# EasyEDA schematic SCH_Glucosan2-DetectorSide.json
TITLE: Glucosan 2 - Detector Side; REV: 1.0; Date: 2024-07-13; Sheet: 1/1; Drawn By: KnowTheBird; Company: NoninvasiveGlucometer
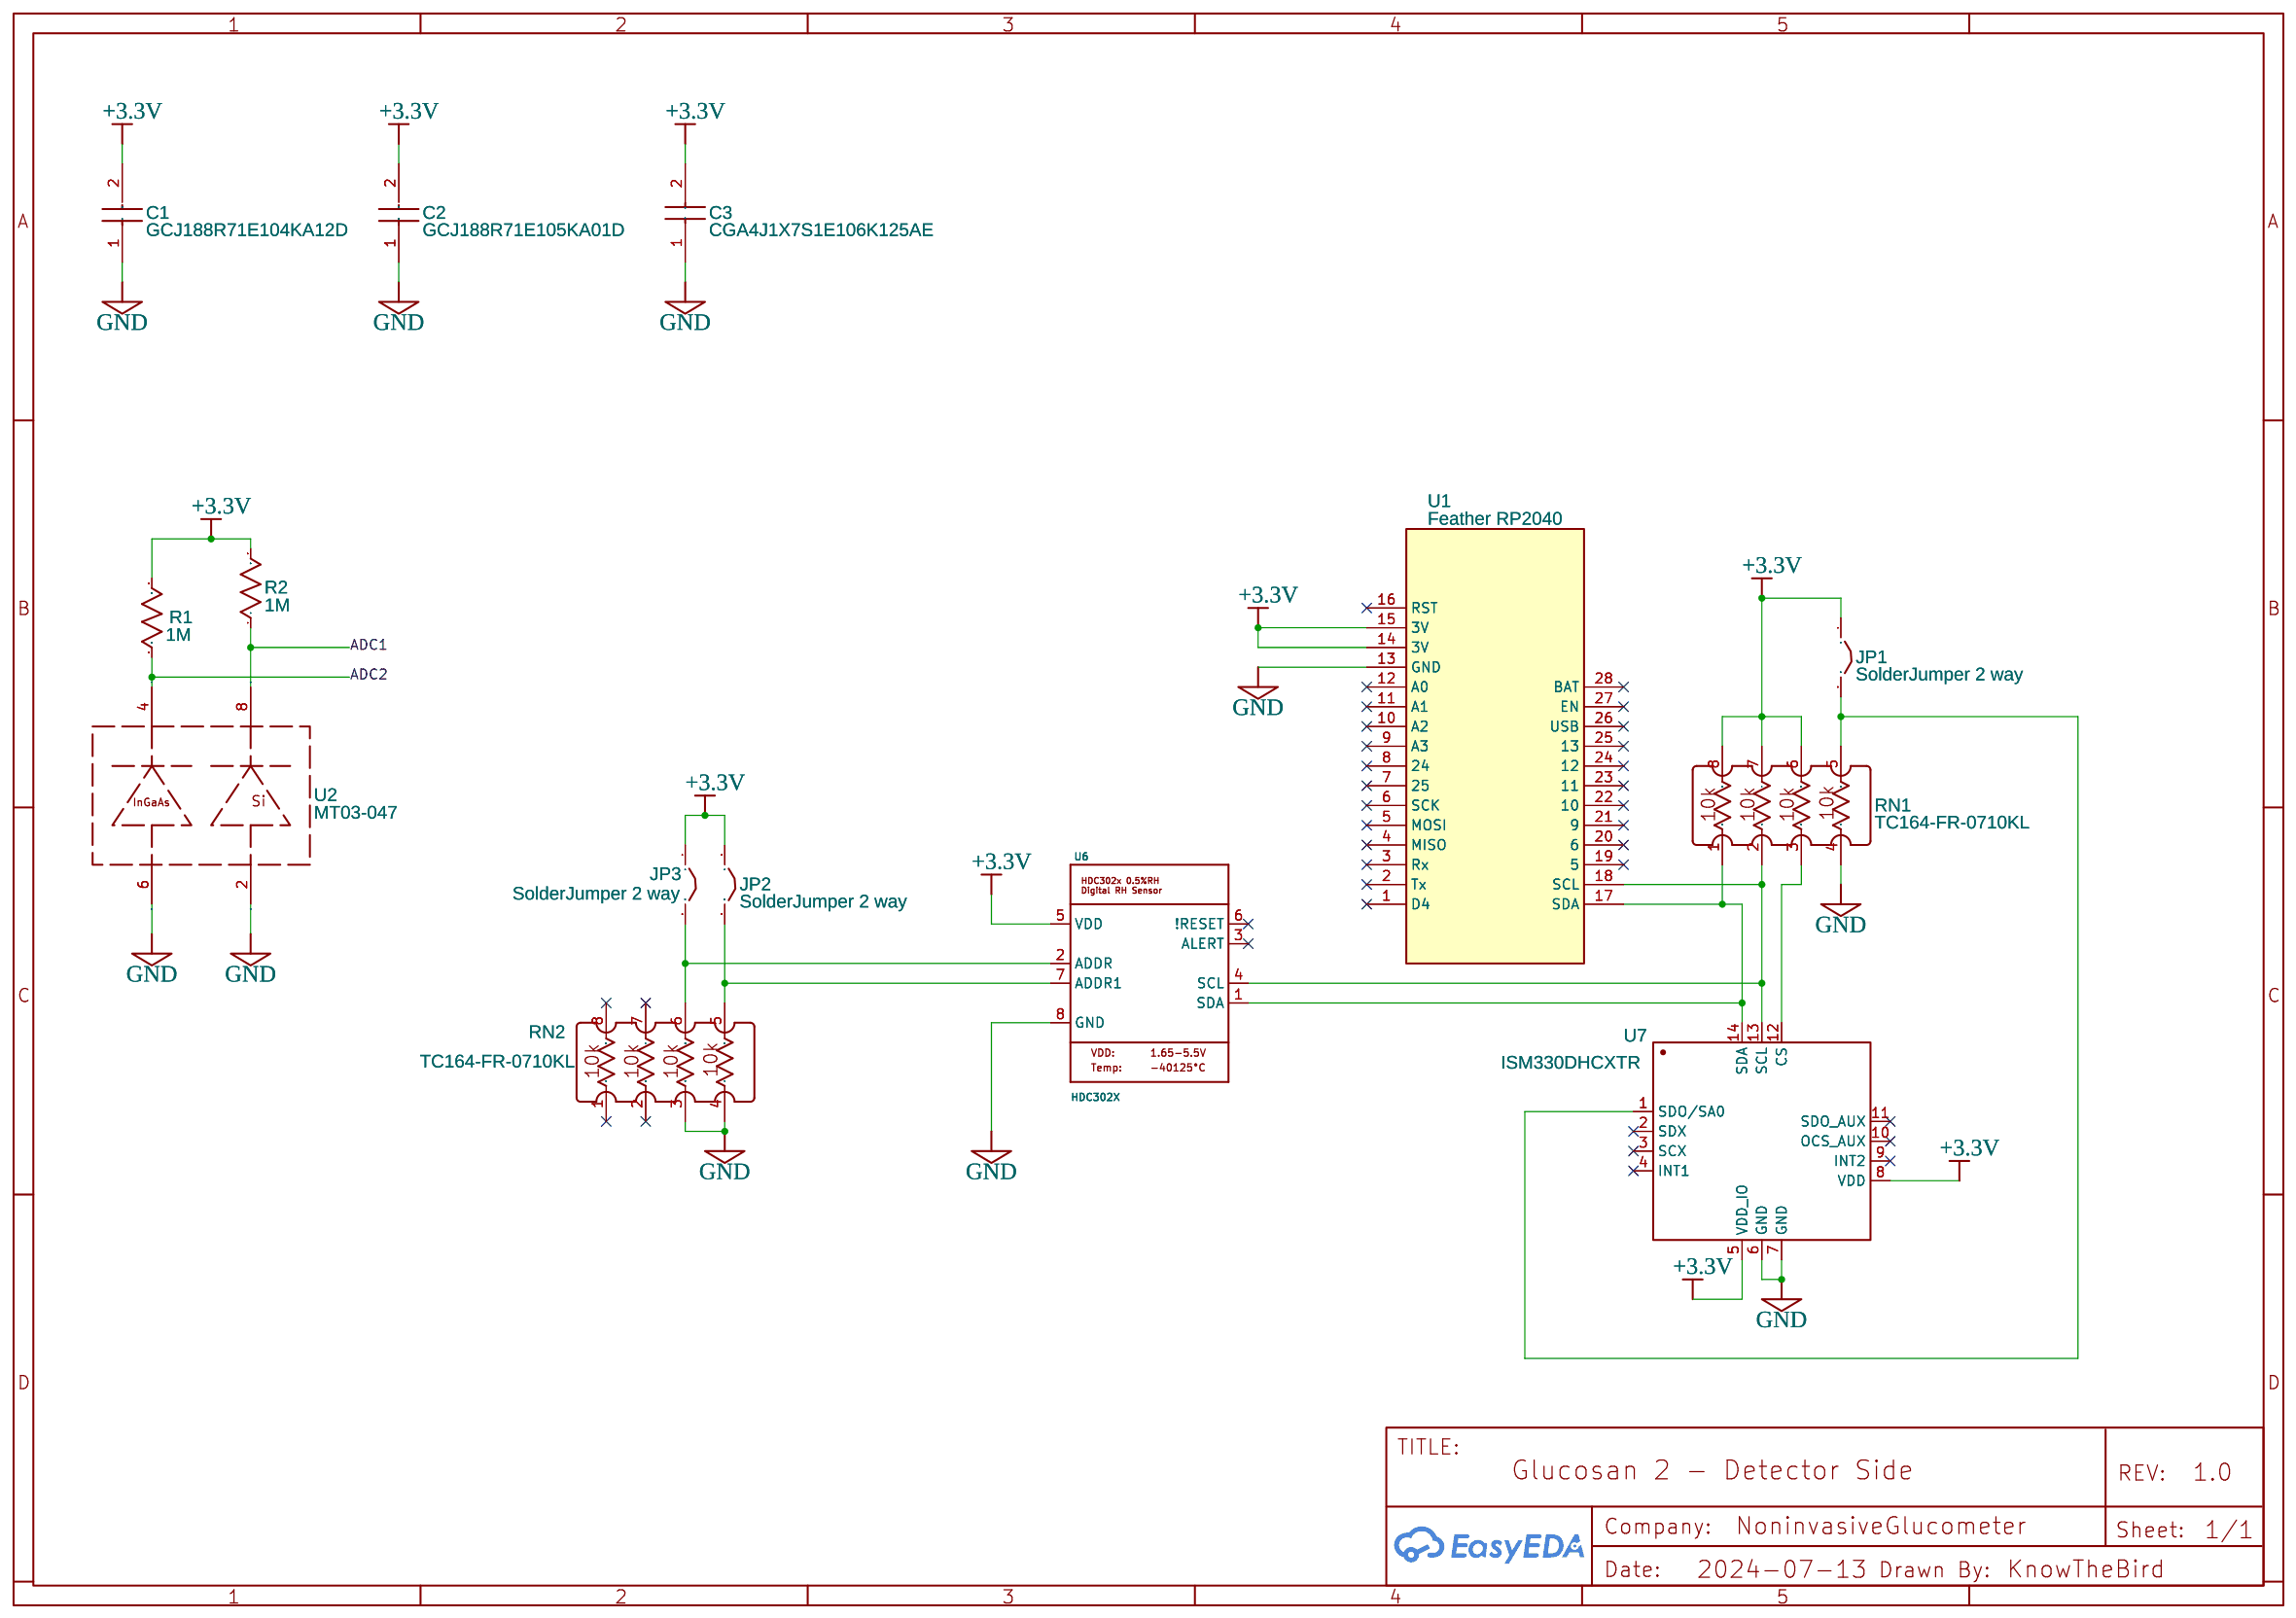
[diagram p0: schematic sheet]

## Parts
C1  GCJ188R71E104KA12D  [CAPC1608X100N]
C2  GCJ188R71E105KA01D  [CAPC1608X100N]
C3  CGA4J1X7S1E106K125AE  [C0805]
JP1  SolderJumper 2 way  [PAD-JUMPER-2-SMD-SOLDER]
JP2  SolderJumper 2 way  [PAD-JUMPER-2-SMD-SOLDER]
JP3  SolderJumper 2 way  [PAD-JUMPER-2-SMD-SOLDER]
R1  1M  [R0603]
R2  1M  [R0603]
RN1  TC164-FR-0710KL  [TC124/164]
RN2  TC164-FR-0710KL  [TC124/164]
U1  Feather RP2040  [FEATHER RP2040]
U2  MT03-047
U6  HDC302X  [WSON8]
U7  ISM330DHCXTR  [LGA-14_L3.0-W2.5-P0.50-BR]

## Library data of the parts
C1 = GCJ188R71E104KA12D: Contributor: OSCARSM
C2 = GCJ188R71E105KA01D: Contributor: OSCARSM
C3 = CGA4J1X7S1E106K125AE: Datasheet Link: https://componentsearchengine.com//CGA4J1X7S1E106K125AE.pdf; Height: 1.45mm; Mouser2 Part Number: 810-CGA4J1X7S1E106K2; Mouser2 Price/Stock: https://www.mouser.com/Search/Refine.aspx?Keyword=810-CGA4J1X7S1E106K2; Manufacturer_Name: TDK; Contributor: quayen01
JP1-JP3 = Jumper Solder Bridge SMD: Contributor: Sparkytearle
R1 R2 = R_0603_US: Contributor: LCEDA_Lib
RN1 RN2 = TC164-FR-0710KL: Manufacturer: Yageo; Supplier: Digi-Key; Supplier Part: YAG3410TR-ND; Contributor: bryan_6020
U1 = Feather RP2040: sourceId: 1T5FDZYC8; Manufacturer: Adafruit; link: https://learn.adafruit.com/adafruit-feather-rp2040-pico; Contributor: JVSI
U2 = MT03-047: Manufacturer: Marktech Optoelectronics; Supplier: Digi-Key; Supplier Part: 1125-1466-ND; link: https://specs.marktechopto.com/pdf/products/DataSheet/MT03-047.pdf; Contributor: knowthebird; Package Display: No
U6 = -: Package Display: No
U7 = ISM330DHCXTR: Contributor: LCSC; Supplier: LCSC; Supplier Part: C2655101; Manufacturer: ST(意法半导体); JLCPCB Part Class: Extended Part

## Nets
+3.3V: C1.2 C2.2 C3.2 JP1.1 JP2.1 JP3.1 R1.2 R2.2 RN1.6 RN1.7 RN1.8 U1.14(3V) U1.15(3V) U6.5(VDD) U7.5(VDD_IO) U7.8(VDD)
GND: C1.1 C2.1 C3.1 RN1.4 RN2.3 RN2.4 U1.13(GND) U2.2 U2.6 U6.8(GND) U7.6(GND) U7.7(GND)
ADC1: R2.1 U2.8
ADC2: R1.1 U2.4
Net-(JP1-2): JP1.2 RN1.5 U7.1(SDO/SA0)
Net-(JP2-2): JP2.2 RN2.5 U6.7(ADDR1)
Net-(JP3-2): JP3.2 RN2.6 U6.2(ADDR)
Net-(RN1-1): RN1.1 U1.17(SDA) U6.1(SDA) U7.14(SDA)
Net-(RN1-2): RN1.2 U1.18(SCL) U6.4(SCL) U7.13(SCL)
Net-(RN1-3): RN1.3 U7.12(CS)

Not connected (* = marked no-connect by the designer): RN2 1* 2* 7* 8*; U1 1(D4)* 2(Tx)* 3(Rx)* 4(MISO)* 5(MOSI)* 6(SCK)* 7(25)* 8(24)* 9(A3)* 10(A2)* 11(A1)* 12(A0)* 16(RST)* 19(5)* 20(6)* 21(9)* 22(10)* 23(11)* 24(12)* 25(13)* 26(USB)* 27(EN)* 28(BAT)*; U6 3(ALERT)* 6(!RESET)*; U7 2(SDX)* 3(SCX)* 4(INT1)* 9(INT2)* 10(OCS_AUX)* 11(SDO_AUX)*
